# EAGLE schematic rev16 (EAGLE 7.5.0)
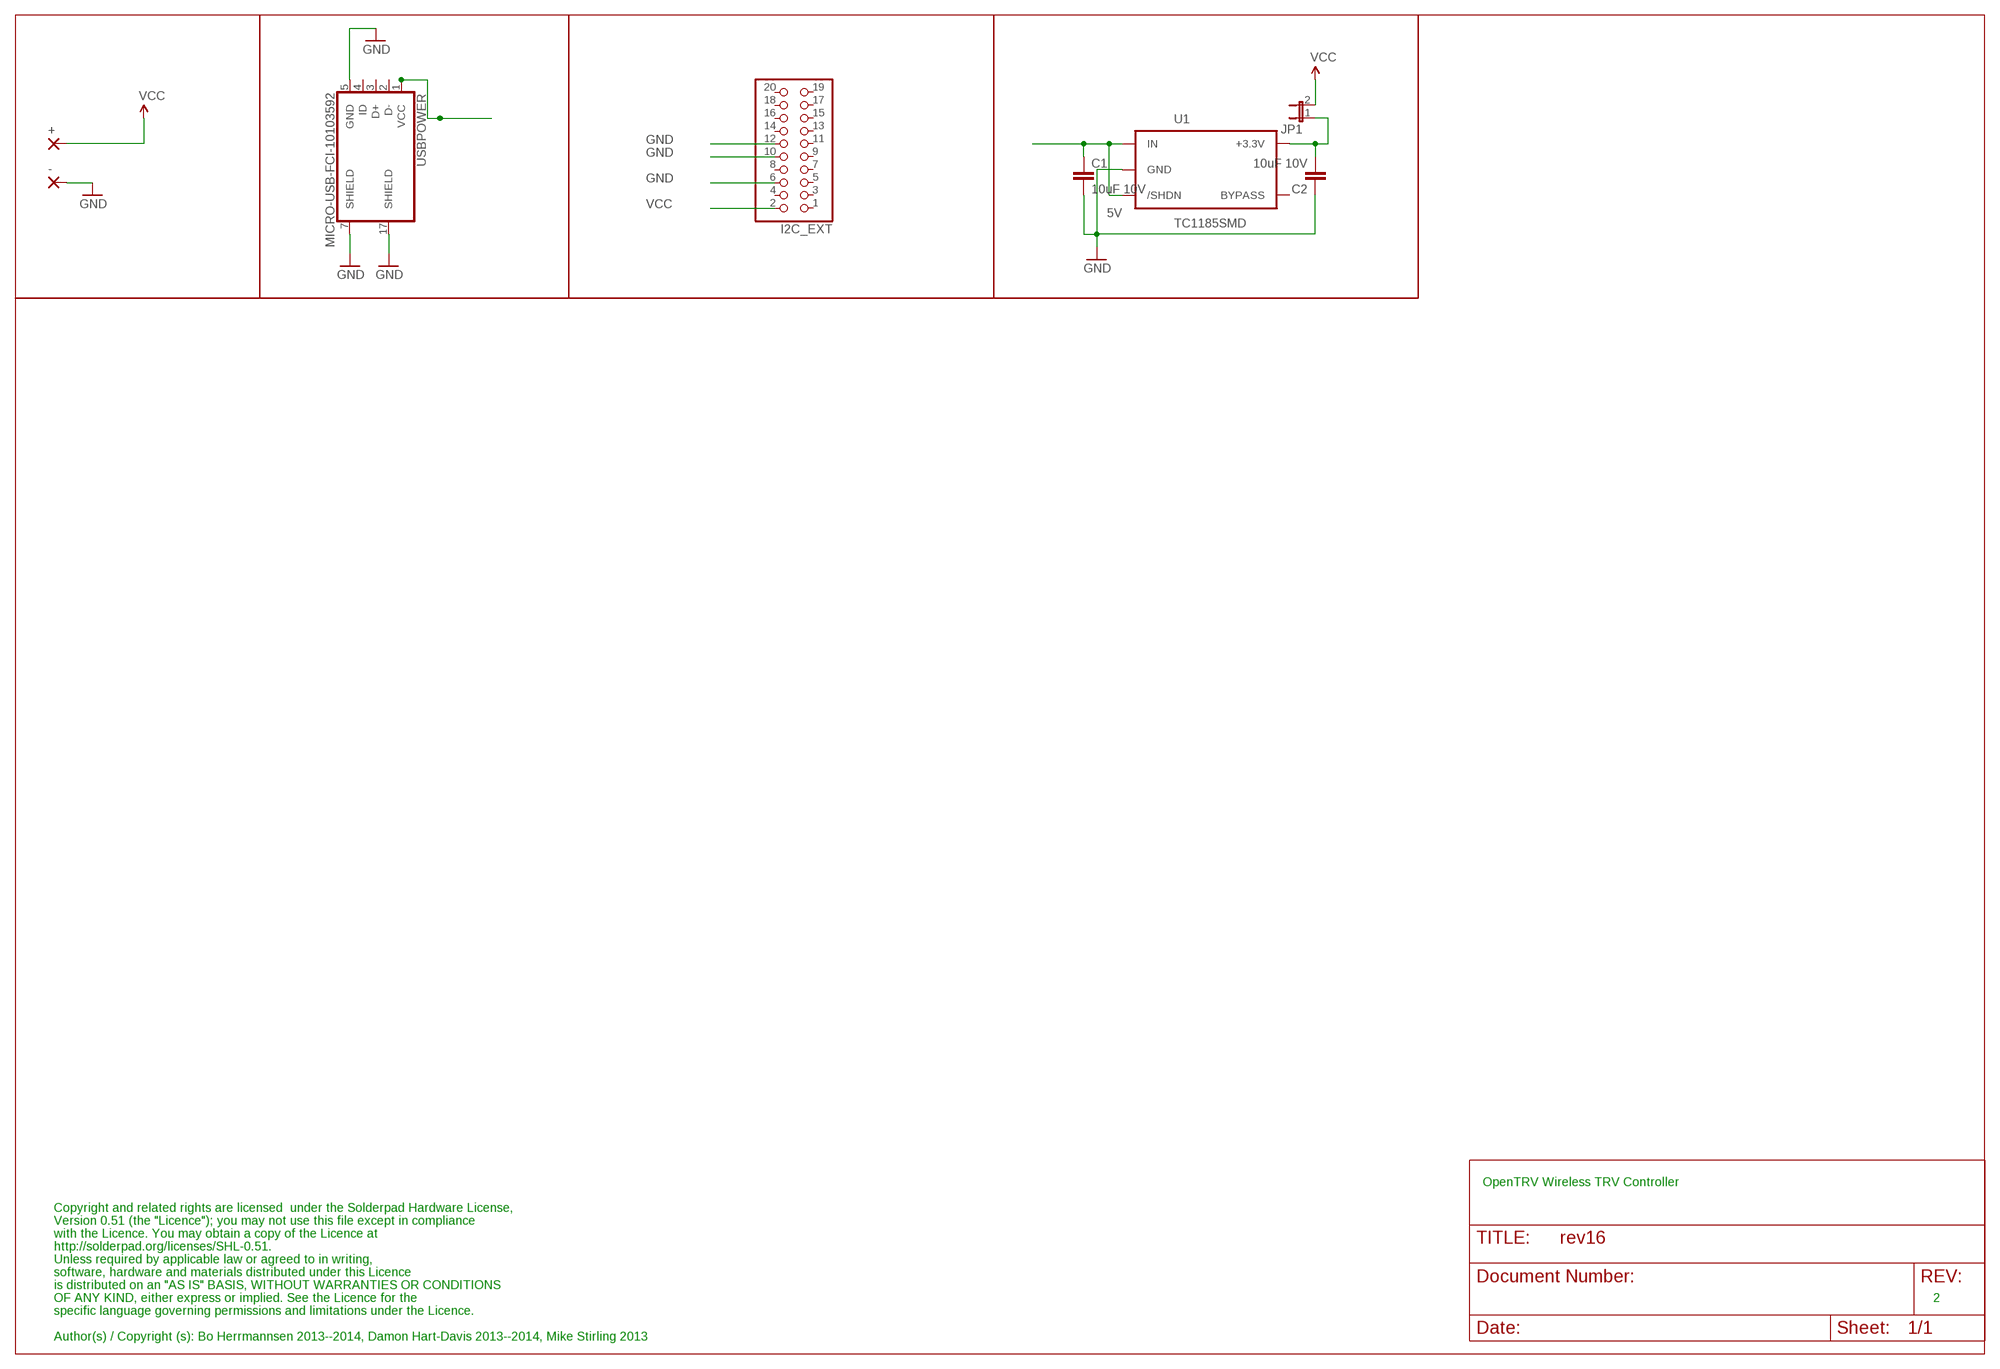
[diagram p0: schematic, sheet 1]

## Parts
+  2,15/1,0  [2,15/1,0]
-  2,15/1,0  [2,15/1,0]
C1  10uF 10V  CAP0603-CAP  [0603-CAP]
C2  10uF 10V  CAP0603-CAP  [0603-CAP]
I2C_EXT  PINHD-2X10  [2X10]
JP1  JP1E  [JP1]
U1  TC1185SMD  [TC1185]
USBPOWER  MICRO-USB-FCI-10103592  [MICRO-USB-FCI-10103592]

## Nets
5V [supply]: C1.1 U1.1(IN) U1.3(/SHDN) USBPOWER.1(VCC)
GND [supply]: -.1(P) C1.2 C2.1 I2C_EXT.6 I2C_EXT.10 I2C_EXT.12 U1.2(GND) USBPOWER.5(GND) USBPOWER.7(SHIELD) USBPOWER.17(SHIELD)
N$8 [supply]: C2.2 JP1.1 U1.5(+3.3V)
VCC [supply]: +.1(P) I2C_EXT.2 JP1.2
Unconnected: I2C_EXT.1 I2C_EXT.3 I2C_EXT.4 I2C_EXT.5 I2C_EXT.7 I2C_EXT.8 I2C_EXT.9 I2C_EXT.11 I2C_EXT.13 I2C_EXT.14 I2C_EXT.15 I2C_EXT.16 I2C_EXT.17 I2C_EXT.18 I2C_EXT.19 I2C_EXT.20 U1.4(BYPASS) USBPOWER.2(D-) USBPOWER.3(D+) USBPOWER.4(ID)

## Notes on the sheet
- OpenTRV Wireless TRV Controller
- Copyright and related rights are licensed  under the Solderpad Hardware License,
- Version 0.51 (the "Licence"); you may not use this file except in compliance
- with the Licence. You may obtain a copy of the Licence at
- http://solderpad.org/licenses/SHL-0.51.
- Unless required by applicable law or agreed to in writing,
- software, hardware and materials distributed under this Licence
- is distributed on an "AS IS" BASIS, WITHOUT WARRANTIES OR CONDITIONS
- OF ANY KIND, either express or implied. See the Licence for the | 2
- specific language governing permissions and limitations under the Licence.
- Author(s) / Copyright (s): Bo Herrmannsen 2013--2014, Damon Hart-Davis 2013--2014, Mike Stirling 2013

## Library data of the parts
+ - = wirepad:2,15/1,0: THROUGH-HOLE PAD
C1 C2 = SparkFun-Passives:CAP: Capacitor Standard 0603 ceramic capacitor, and 0.1" leaded capacitor.
I2C_EXT = pinhead:PINHD-2X10: PIN HEADER
JP1 = jumper:JP1E: JUMPER
U1 = 3.3VREG:TC1185
USBPOWER = micro-usb-fci-10103592:MICRO-USB-FCI-10103592: Micro USB B Connector RS No: 714-2334 MRF No: 10103592-0001LF

## Net classes
0 default: width 0.203 mm
1 supply: width 0.406 mm, clearance 0.203 mm
2 ant: width 2.184 mm